# EAGLE design board1 (EAGLE 9.6.2)
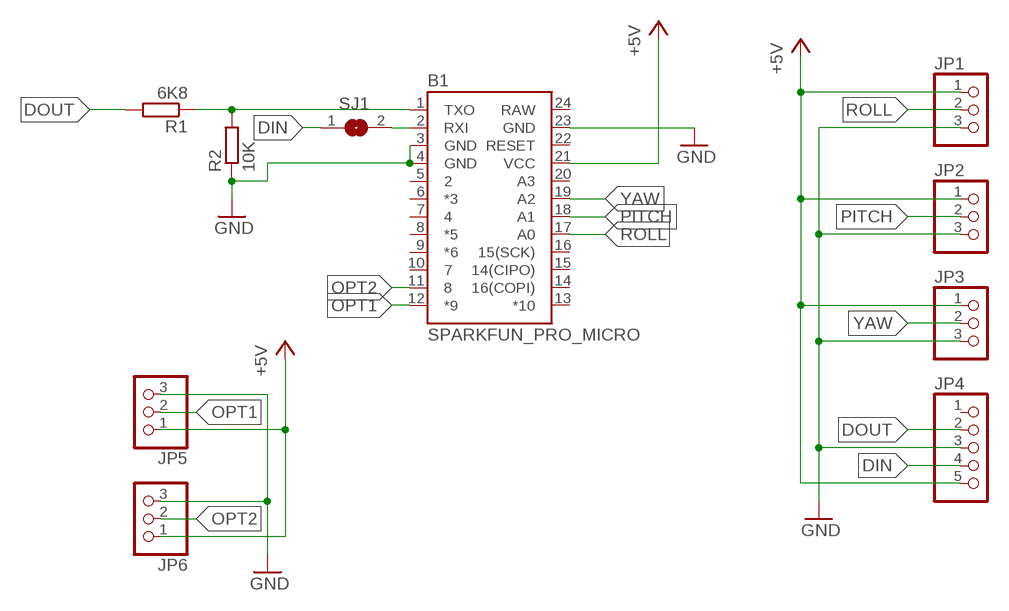
[diagram p0: schematic, sheet 1]

## Parts
B1  SPARKFUN_PRO_MICRO  [SPARKFUN_PRO_MICRO]
JP1  PINHD-1X3  [1X03]
JP2  PINHD-1X3  [1X03]
JP3  PINHD-1X3  [1X03]
JP4  PINHD-1X5  [1X05]
JP5  PINHD-1X3  [1X03]
JP6  PINHD-1X3  [1X03]
R1  6K8  R-EU_R0603  [R0603]
R2  10K  R-EU_R0603  [R0603]
SJ1  SJ  [SJ]

## Nets
+5V: B1.21(VCC) JP1.1 JP2.1 JP3.1 JP4.5 JP5.1 JP6.1
DIN: JP4.4 SJ1.1
DOUT: JP4.2 R1.2
GND: B1.3(GND) B1.4(GND) B1.23(GND) JP1.3 JP2.3 JP3.3 JP4.3 JP5.3 JP6.3 R2.1
N$1: B1.1(TXO) R1.1 R2.2
N$2: B1.2(RXI) SJ1.2
OPT1: B1.12(*9) JP5.2
OPT2: B1.11 JP6.2
PITCH: B1.18(A1) JP2.2
ROLL: B1.17(A0) JP1.2
YAW: B1.19(A2) JP3.2
Unconnected: B1.5 B1.6(*3) B1.7 B1.8(*5) B1.9(*6) B1.10 B1.13(*10) B1.14(16(COPI)) B1.15(14(CIPO)) B1.16(15(SCK)) B1.20(A3) B1.22(RESET) JP4.1

## Power pins joined to a net without a drawn wire
RAW: B1.24(RAW)

## Library data of the parts
B1 = SparkFun-Boards:SPARKFUN_PRO_MICRO: SparkFun Pro Micro Atmega32U4 compatible footprint. SparkFun Products: 3.3V/8MHz <https://www.sparkfun.com/products/12587> 5V/16MHz <https://www.sparkfun.com/products/12640>
JP1-JP3 JP5 JP6 = pinhead:PINHD-1X3: PIN HEADER
JP4 = pinhead:PINHD-1X5: PIN HEADER
R1 R2 = rcl:R-EU_: RESISTOR, European symbol; SPICEPREFIX: R
SJ1 = jumper:SJ: SMD solder JUMPER

## Board
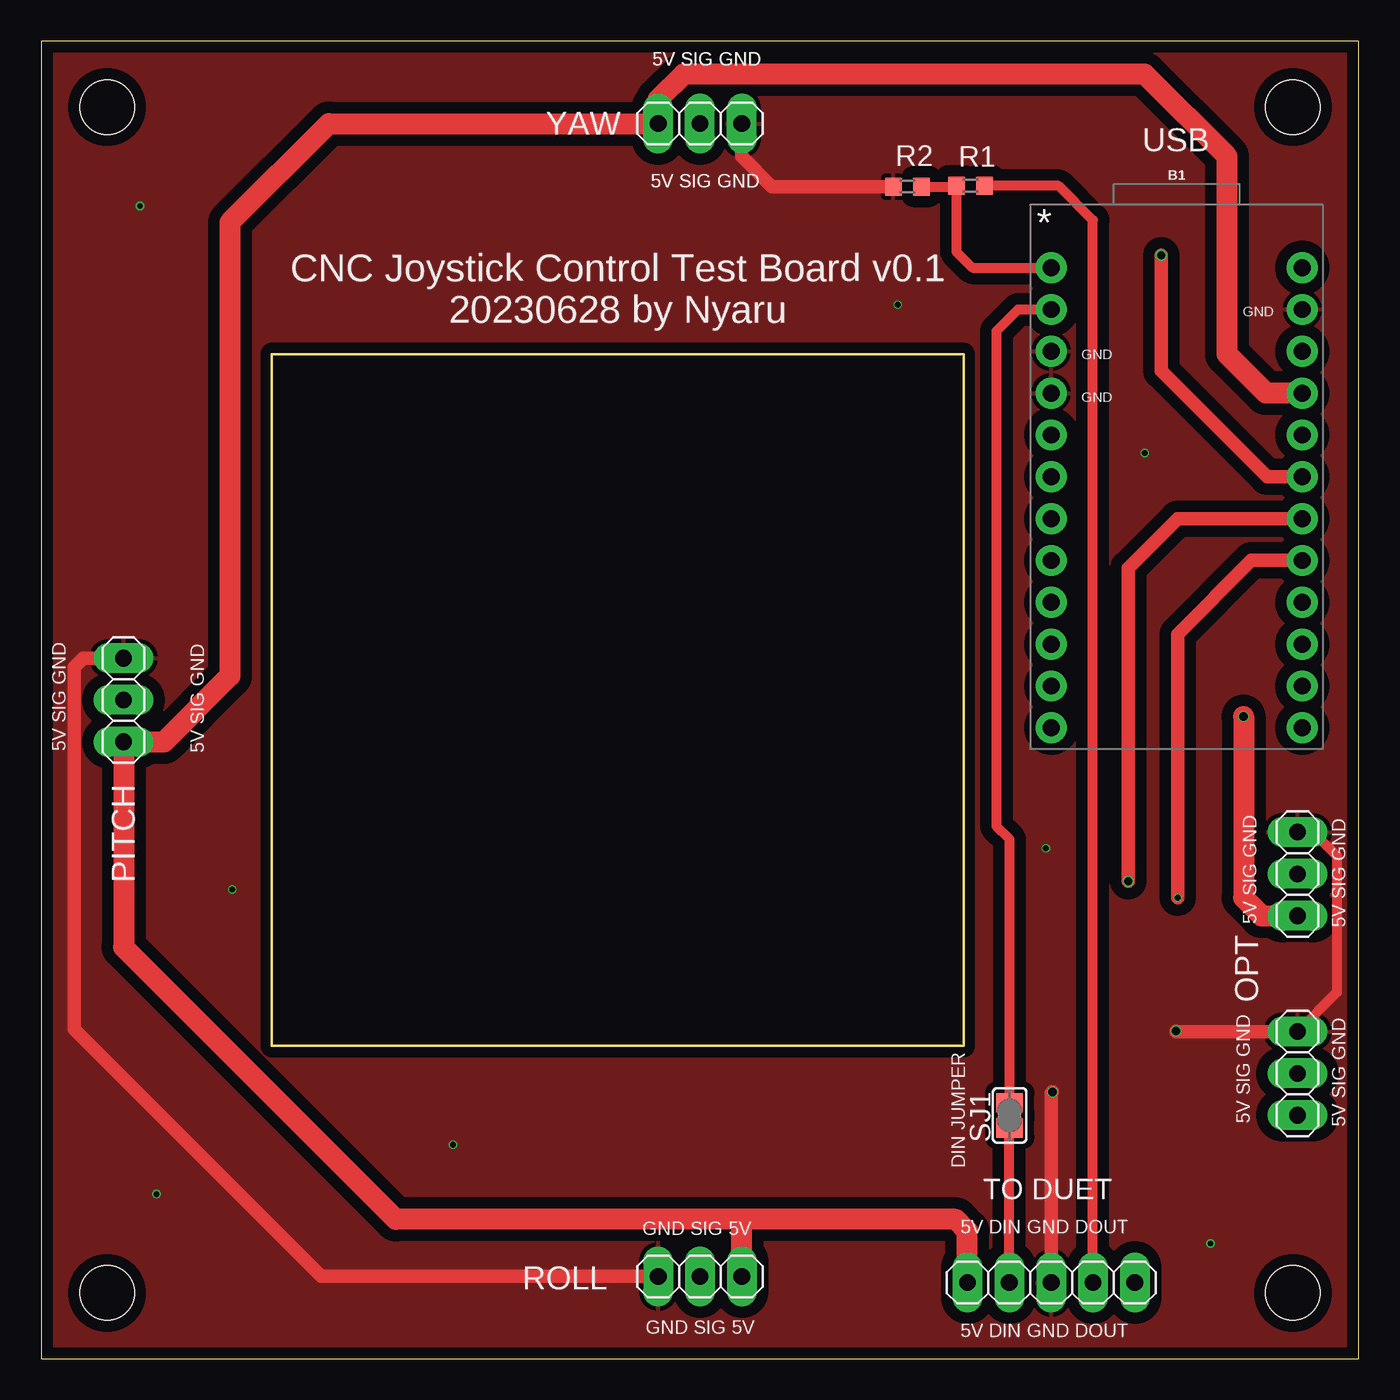
[diagram p1: board, top side]
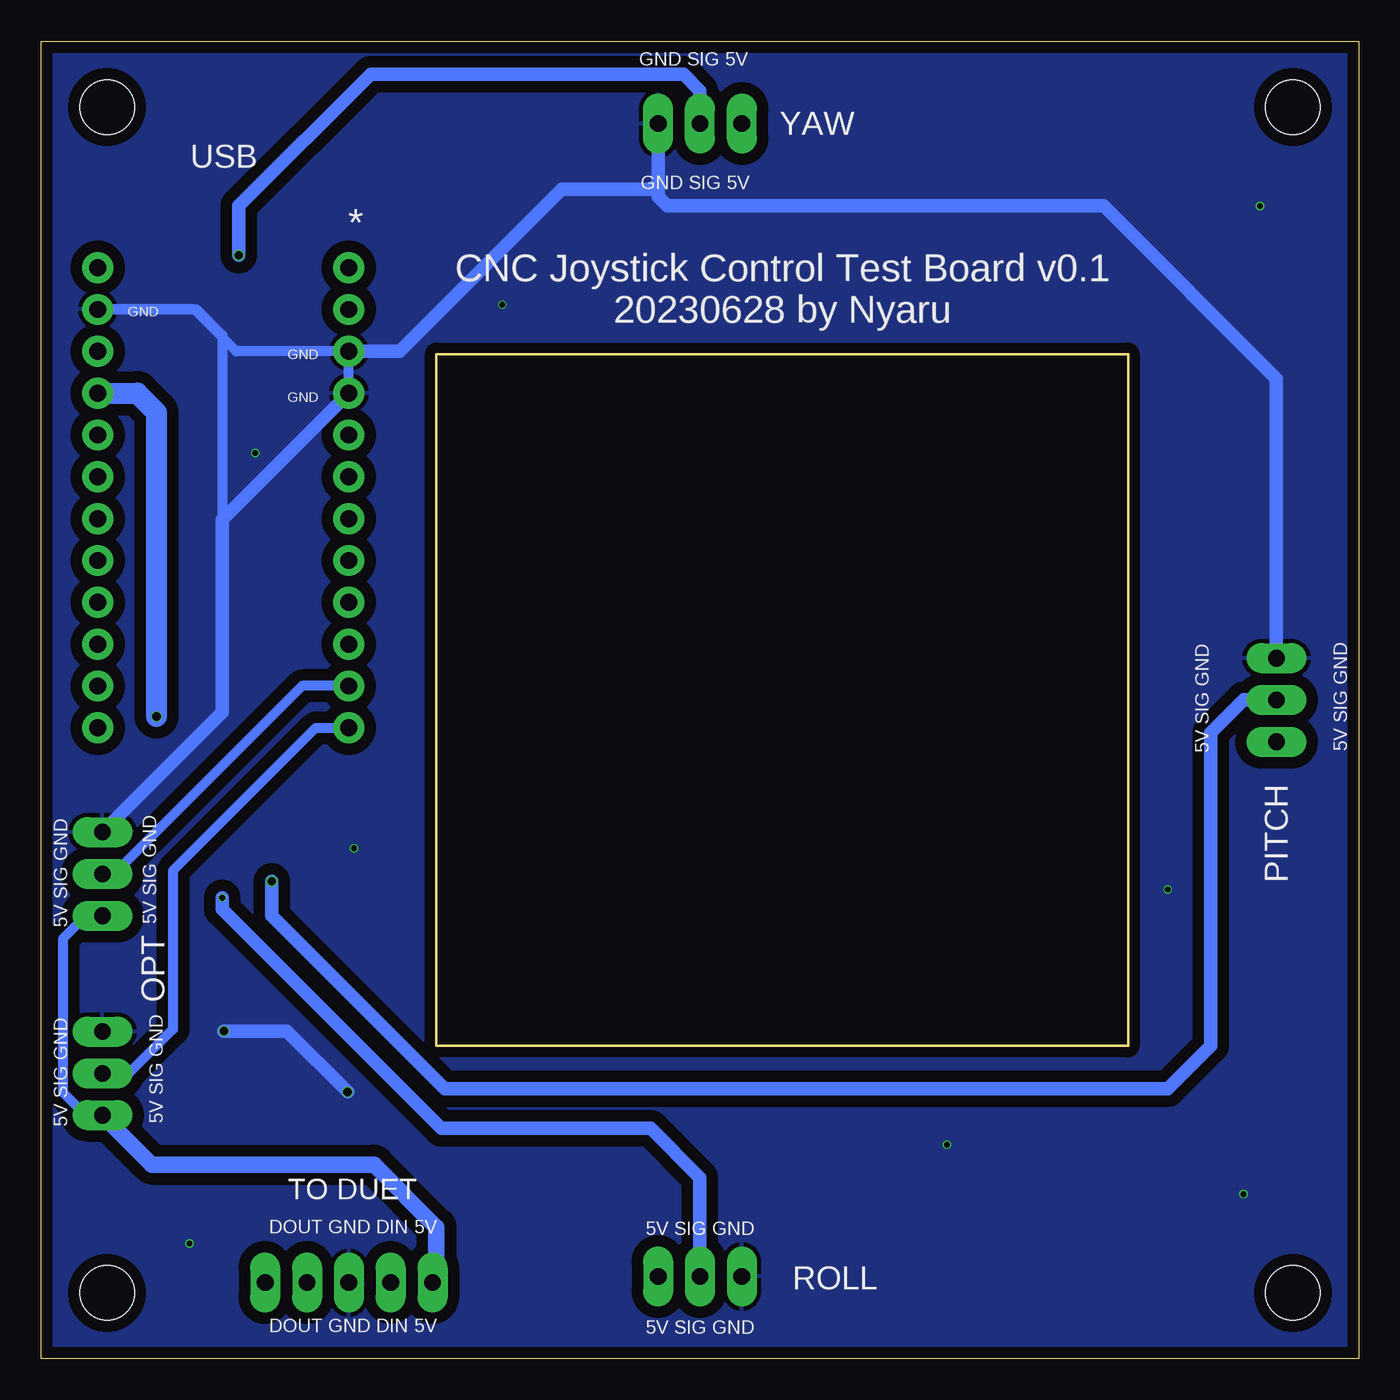
[diagram p2: board, bottom side, seen from below]

Size 80 x 80 mm. Coordinates in mm from the lower left corner, seen from the top.
Outline: 0,0 80,0 80,80 0,80 0,0
Copper layers (1*16): Top 0.035mm / dielectric 1.6mm / Bottom 0.035mm
Design rules "jlcpcb-2layers": minimum track width 5mil, minimum drill 0.3mm, track to track 5mil, track to pad 5mil, pad to pad 5mil, via to via 5mil, smd to smd 5mil, copper to edge 0.2mm, drill to drill 6mil, minimum pad ring 10mil, minimum via ring 3mil, stop-mask expansion 4mil, vias tented up to drill 0mil, thermal gap 10mil
Holes 3.3 mm at 4,4 76,4 4,76 76,76
tRestrict: area 14,19 to 56,61
bRestrict: area 14,19 to 56,61
Milling: 4 lines

### Footprints (pad centres in the part's own frame; a part is rotated, then mirrored left to right if it is on the bottom)
SPARKFUN_PRO_MICRO = drill 1.016 pad 1.88: 1 -7.62,12.7; 2 -7.62,10.16; 3 -7.62,7.62; 4 -7.62,5.08; 5 -7.62,2.54; 6 -7.62,0; 7 -7.62,-2.54; 8 -7.62,-5.08; 9 -7.62,-7.62; 10 -7.62,-10.16; 11 -7.62,-12.7; 12 -7.62,-15.24; 13 7.62,-15.24; 14 7.62,-12.7; 15 7.62,-10.16; 16 7.62,-7.62; 17 7.62,-5.08; 18 7.62,-2.54; 19 7.62,0; 20 7.62,2.54; 21 7.62,5.08; 22 7.62,7.62; 23 7.62,10.16; 24 7.62,12.7
1X03 = drill 1.016 long: 1 -2.54,0; 2 0,0; 3 2.54,0
1X05 = drill 1.016 long: 1 -5.08,0; 2 -2.54,0; 3 0,0; 4 2.54,0; 5 5.08,0
R0603 = smd 1 x 1.1: 1 -0.85,0; 2 0.85,0
SJ = smd 1.168 x 1.6: 1 -0.762,0; 2 0.762,0

### Placement (x,y rotation side)
B1  68.94,53.55 0 top
JP1  40,5 180 top
JP2  5,40 90 top
JP3  40,75 0 top
JP4  61.32,4.63 180 top
JP5  76.28,17.33 90 top
JP6  76.28,29.44 90 top
R1  56.42,71.22 0 top
R2  52.59,71.17 0 top
SJ1  58.8,14.78 90 top

### Tracks (layer width: path | path; a pad name or v marks a point on that pad's centre or on a via)
+5V  (via drill 0.5)
  Top 1.27: B1.21 74.37,58.63 72,61 72,73 67,78 39,78 37.46,76.46 JP3.1 17.46,75 11.46,69 11.46,41.46 7.46,37.46 JP2.1 5,25 21.54,8.46 42.54,8.46 | JP1.1 42.54,8.46 | JP4.5 56.24,7.76 55.54,8.46 42.54,8.46 | v73,39 73,28 74.1,26.9 JP6.1
  Bottom 0.61: JP6.1 77.28,26.9 78.68,25.5 78.68,16.19 77.28,14.79 JP5.1
  Bottom 0.813: 56,4.87 JP4.5
  Bottom 1.016: JP5.1 73.28,11.79 59.79,11.79 56,8 56,4.87
  Bottom 1.27: B1.21 74.16,58.63 73,57.47 v73,39
DIN
  Top 0.61: JP4.4 58.78,14 SJ1.1
DOUT
  Top 0.61: JP4.2 63.86,69.14 61.78,71.22 R1.2
GND  (via drill 0.35, 0.5)
  Top 0.61: JP5.3 78.66,22.25 78.66,30.55 77.23,31.98 JP6.3
  Top 0.813: JP5.3 68.93,19.87 v68.9,19.9 | v61.4,16.2 61.32,16.12 JP4.3 | JP1.3 17,5 2,20 2,42 2.54,42.54 JP2.3 | R2.1 44.37,71.17 42.54,73 JP3.3
  Bottom 0.61: B1.4 B1.3 68.17,61.17 70.71,63.71 B1.23 70.56,63.71 69,62.15 69,50.95
  Bottom 0.813: B1.4 69,50.95 69,39.26 JP6.3 | v68.9,19.9 65.1,19.9 v61.4,16.2 | JP2.3 5,59.5 15.5,70 42,70 42.54,70.54 JP3.3 42.54,71.4 42.94,71 48.39,71 58.22,61.17 B1.3
  other vias: 25,13 6,70 67,55 7,10 71,7 61,31 11.6,28.5 52,64
  pour Bottom (isolate 0.7): -4,84 84,84 84,-10 -4,-10
  pour Top (isolate 0.7): -7,84 83,84 83,-10 -7,-10
N$1
  Top 0.61: R2.2 55.52,71.17 R1.1 55.57,67.22 56.54,66.25 B1.1
N$2
  Top 0.61: SJ1.2 58.8,31.54 58,32.34 58,62.39 59.32,63.71 B1.2
OPT1
  Bottom 0.61: B1.12 63.32,38.31 72,29.63 72,20 74.67,17.33 JP5.2
OPT2
  Bottom 0.61: B1.11 64.15,40.85 75.56,29.44 JP6.2
PITCH  (via drill 0.5)
  Top 0.813: v66,29 66,48 69.01,51.01 B1.18
  Bottom 0.813: JP2.2 7,40 9,38 9,19 11.6,16.4 55.5,16.4 66,26.9 v66,29
ROLL  (via drill 0.35)
  Top 0.813: v69,28 69,44 73.47,48.47 B1.17
  Bottom 0.813: JP1.2 40,11 43,14 55.7,14 69,27.3 v69,28
YAW  (via drill 0.5)
  Top 0.813: v68,67 68,60 74.45,53.55 B1.19
  Bottom 0.813: JP3.2 40,77 41,78 60,78 68,70 v68,67

### Text on the board
tPlace: 5V SIG GND | 5V SIG GND | YAW | USB | 5V SIG GND | 5V SIG GND | * | CNC Joystick Control Test Board v0.1 / 20230628 by Nyaru | GND | GND | GND | 5V SIG GND | 5V SIG GND | PITCH | 5V SIG GND | 5V SIG GND | OPT | 5V SIG GND | 5V SIG GND | DIN JUMPER | TO DUET | GND SIG 5V | 5V DIN GND DOUT | ROLL | GND SIG 5V | 5V DIN GND DOUT
bPlace: GND SIG 5V | YAW | USB | GND SIG 5V | * | CNC Joystick Control Test Board v0.1 / 20230628 by Nyaru | GND | GND | GND | 5V SIG GND | 5V SIG GND | PITCH | 5V SIG GND | 5V SIG GND | OPT | 5V SIG GND | 5V SIG GND | TO DUET | 5V SIG GND | DOUT GND DIN 5V | ROLL | 5V SIG GND | DOUT GND DIN 5V